# Altium schematic sheet VIPER 3303.SchDoc
size A4
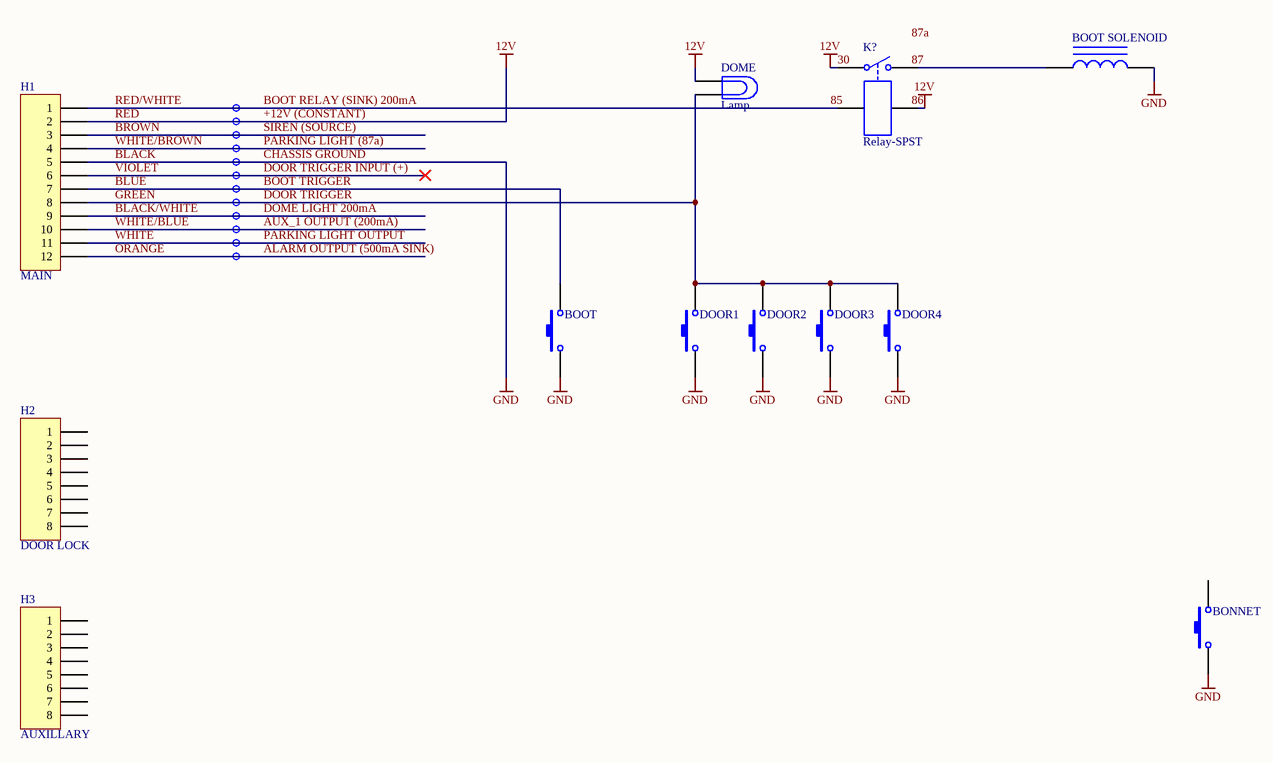
[diagram p0: VIPER 3303.SchDoc]

## Parts
BONNET  SW-PB  [SPST-2]  (value not drawn)
BOOT  SW-PB  [SPST-2]  (value not drawn)
BOOT_SOLENOID  Inductor Iron  [AXIAL-0.9]  (value not drawn)
DOME  Lamp  [PIN2]
DOOR1  SW-PB  [SPST-2]  (value not drawn)
DOOR2  SW-PB  [SPST-2]  (value not drawn)
DOOR3  SW-PB  [SPST-2]  (value not drawn)
DOOR4  SW-PB  [SPST-2]  (value not drawn)
H1  MAIN  [HDR1X12]
H2  DOOR LOCK  [HDR1X8]
H3  AUXILLARY  [HDR1X8]
K?  Relay-SPST  [MODULE4]

## Nets
+12V (CONSTANT): DOME.1 H1.2 K?.1 K?.4  [also labelled 12V, 30, RED]
BLACK: BONNET.1 BOOT.1 BOOT_SOLENOID.2 DOOR1.1 DOOR2.1 DOOR3.1 DOOR4.1 H1.5  [also labelled CHASSIS GROUND, GND]
85: H1.1 K?.3  [also labelled BOOT RELAY (SINK) 200mA, RED/WHITE]
ALARM OUTPUT (500mA SINK): H1.12  [also labelled ORANGE]
AUX_1 OUTPUT (200mA): H1.10  [also labelled WHITE/BLUE]
BLACK/WHITE: H1.9  [also labelled DOME LIGHT 200mA]
BLUE: BOOT.2 H1.7  [also labelled BOOT TRIGGER]
BROWN: H1.3  [also labelled SIREN (SOURCE)]
DOOR TRIGGER: DOME.2 DOOR1.2 DOOR2.2 DOOR3.2 DOOR4.2 H1.8  [also labelled GREEN]
DOOR TRIGGER INPUT (+): H1.6  [also labelled VIOLET]
PARKING LIGHT (87a): H1.4  [also labelled WHITE/BROWN]
PARKING LIGHT OUTPUT: H1.11  [also labelled WHITE]
NetBOOT_SOLENOID_1: BOOT_SOLENOID.1 K?.2

Not connected (* = marked no-connect by the designer): BONNET 2; H2 1 2 3 4 5 6 7 8; H3 1 2 3 4 5 6 7 8

## Notes on the sheet
- Labels drawn without touching a wire or pin: 86, 87, 87a

## Library data of the parts
BONNET BOOT DOOR1-DOOR4 = SW-PB: Switch; Published: 24-Mar-1999; LatestRevisionDate: 17-Jul-2002; LatestRevisionNote: Re-released for DXP Platform.; PackageReference: SPST-2; Publisher: Altium Limited; PackageDescription: Switch; 2 Leads
BOOT_SOLENOID = Inductor Iron: Magnetic-Core Inductor; Value: 10mH; Published: 24-Mar-1999; LatestRevisionDate: 17-Jul-2002; LatestRevisionNote: Re-released for DXP Platform.; PackageReference: AXIAL-0.9; Publisher: Altium Limited; PackageDescription: Axial Device, Thru-Hole; 2 Leads; 0.9 in Pin Spacing
DOME = Lamp: Incandescent Bulb; Published: 24-Mar-1999; LatestRevisionDate: 17-Jul-2002; LatestRevisionNote: Re-released for DXP Platform.; PackageReference: PIN2; Publisher: Altium Limited
H1 = Header 12: Header, 12-Pin; LatestRevisionDate: 17-Jul-2002; LatestRevisionNote: Re-released for DXP Platform.; Publisher: Altium Limited
H2 H3 = Header 8: Header, 8-Pin; LatestRevisionDate: 17-Jul-2002; LatestRevisionNote: Re-released for DXP Platform.; Publisher: Altium Limited
K? = Relay-SPST: Single-Pole Single-Throw Relay; Published: 24-Mar-1999; LatestRevisionDate: 17-Jul-2002; LatestRevisionNote: Re-released for DXP Platform.; PackageReference: MODULE4; Publisher: Altium Limited